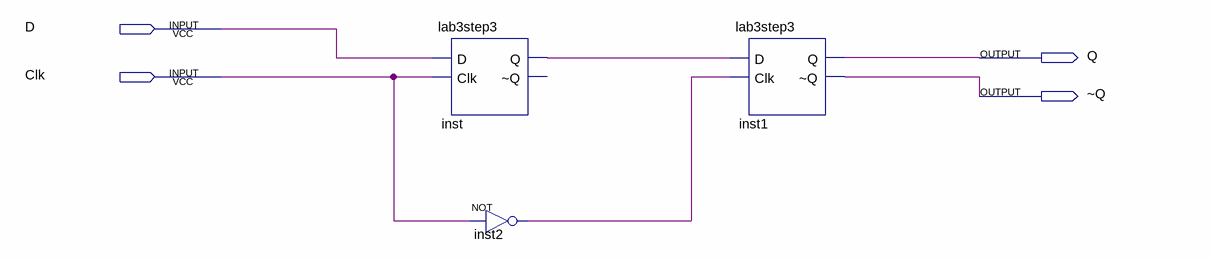
[diagram p0: schematic sheet]
// Quartus schematic lab9step4.bdf as structural Verilog: 3 symbols, 4 pins
module lab9step4 (
  input  D,
  input  Clk,
  output Q,
  output \~Q 
);

  wire inst2_out, inst_q;

  lab3step3 inst (.D(D), .Clk(Clk), .Q(inst_q));  // open: ~Q
  not inst2 (inst2_out, Clk);
  lab3step3 inst1 (.D(inst_q), .Clk(inst2_out), .Q(Q), .\~Q (\~Q ));
endmodule
